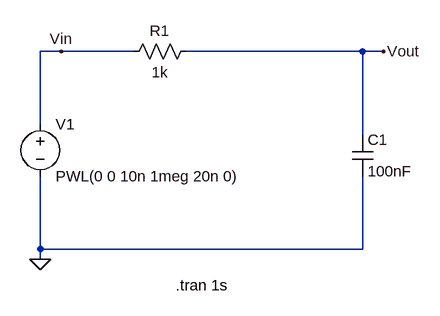
[diagram p0: schematic RC_square_wave.asc]
RC_square_wave.asc, the LTspice schematic file:
Version 4
SHEET 1 880 680
WIRE 144 16 112 16
WIRE 256 16 144 16
WIRE 608 16 336 16
WIRE 640 16 608 16
WIRE 112 128 112 16
WIRE 608 144 608 16
WIRE 112 320 112 208
WIRE 608 320 608 208
WIRE 608 320 112 320
WIRE 112 336 112 320
FLAG 144 16 Vin
FLAG 640 16 Vout
FLAG 112 336 0
SYMBOL voltage 112 112 R0
SYMATTR InstName V1
SYMATTR Value PWL(0 0 10n 1meg 20n 0)
SYMBOL res 352 0 R90
WINDOW 0 0 56 VBottom 2
WINDOW 3 32 56 VTop 2
SYMATTR InstName R1
SYMATTR Value 1k
SYMBOL cap 592 144 R0
SYMATTR InstName C1
SYMATTR Value 100nF
TEXT 320 376 Left 2 !.tran 1s

The netlist it stands for:
* RC_square_wave.asc
V1 Vin 0 PWL(0 0 10n 1meg 20n 0)
R1 Vout Vin 1k
C1 Vout 0 100nF
.tran 1s
.backanno
.end